# Altium project Memory_EEPROM.PrjPcb
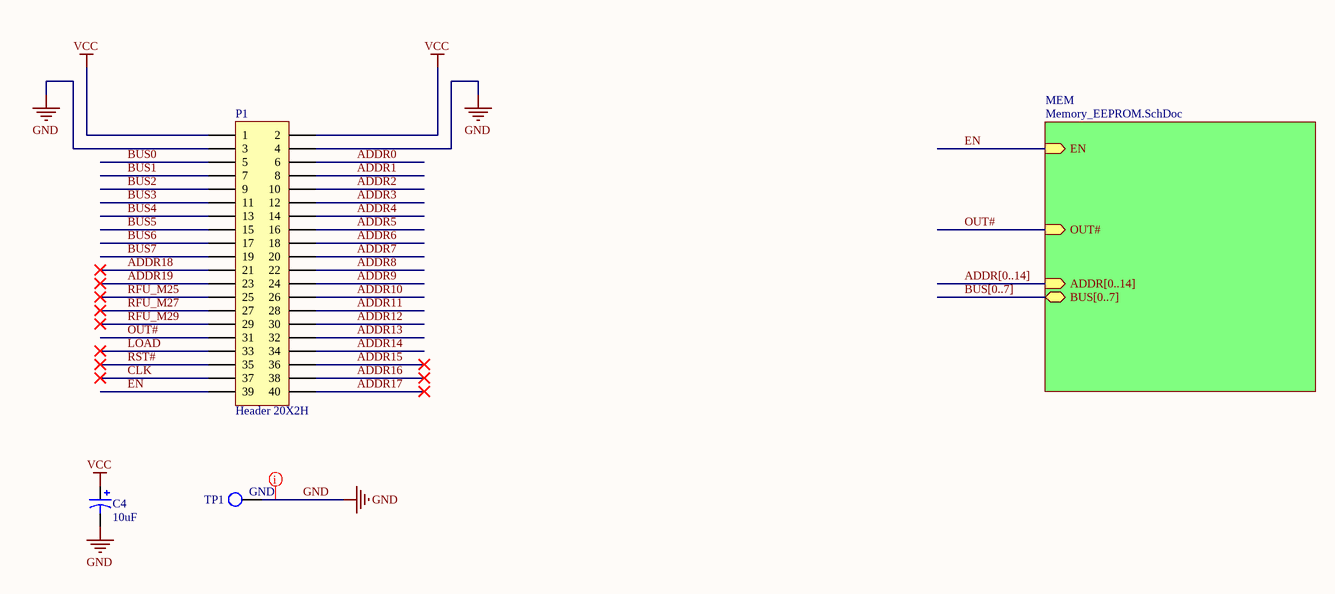
[diagram p0: Top.SchDoc]
2 sheets, 9 parts. Net scope: hierarchical (ports join the sheet entries above them; power ports are global).
Board file: Memory_EEPROM.PcbDoc
Sheets:
  Top.SchDoc
    MEM = Memory_EEPROM.SchDoc

## Sheet Top.SchDoc
size B; Author: E. Sims; Organization: Let's Build Rockets Inc.; SheetNumber: 1; SheetTotal: 2

### Parts
C4  value 10uF  [C5x7]  (hidden comment: Cap Pol5)
P1  Header 20X2H  [HDR2X20H]
TP1  GND  [KSTN-5011_V]  (no BOM)

### Sub-sheets
MEM = Memory_EEPROM.SchDoc: OUT# (in), EN (in), ADDR[0..14] (in), BUS[0..7] (bidir)

### Nets
GND: C4.2 P1.3 P1.4 TP1.1
VCC: C4.1 P1.1 P1.2
ADDR0: P1.6
ADDR1: P1.8
ADDR2: P1.10
ADDR3: P1.12
ADDR4: P1.14
ADDR5: P1.16
ADDR6: P1.18
ADDR7: P1.20
ADDR8: P1.22
ADDR9: P1.24
ADDR10: P1.26
ADDR11: P1.28
ADDR12: P1.30
ADDR13: P1.32
ADDR14: P1.34
ADDR15: P1.36
ADDR16: P1.38
ADDR17: P1.40
ADDR18: P1.21
ADDR19: P1.23
BUS0: P1.5
BUS1: P1.7
BUS2: P1.9
BUS3: P1.11
BUS4: P1.13
BUS5: P1.15
BUS6: P1.17
BUS7: P1.19
CLK: P1.37
EN: P1.39 ; sheet MEM/EN
LOAD: P1.33
OUT#: P1.31 ; sheet MEM/OUT#
RFU_M25: P1.25
RFU_M27: P1.27
RFU_M29: P1.29
RST#: P1.35

### Buses and harness runs
bus ADDR[0..14] = sheet MEM/ADDR[0..14]
bus BUS[0..7] = sheet MEM/BUS[0..7]

### Layout directives
rule Width Constraint [Pref Width = 20mil    Min Width = 20mil    Max Width = 50mil]; rule Routing Via Style [Pref Size = 35mil    Pref Hole Size = 20mil]; net class PWR: GND

### Notes on the sheet
- Let's Build Rocket's Inc. Modular Paylaod System Based on TMP-010 Rev
  For more information visit https://github.com/LetsBuildRockets/Modular-Payload-System
  This work is licensed under CC BY-NC 4.0. To view a copy of this license, visit https://creativecommons.org/licenses/by-nc/4.0
- Title
- Size:
- Date:
- Assembly Variant:
- B
- Number:
- Time:
- Revision:
- Sheet
- of
- Author:
- File:

### Library data of the parts
C4 = Cap Pol5: Polarized Capacitor; Published: 8-Jun-2000; LatestRevisionDate: 17-Jul-2002; LatestRevisionNote: Re-released for DXP Platform.; PackageReference: POLAR0.8; Publisher: Altium Limited; PackageDescription: Polarized Capacitor; 2 Leads
P1 = Header 20X2H: Header, 20-Pin, Dual row, Right Angle; System: Connector; LatestRevisionDate: 17-Jul-2002; LatestRevisionNote: Re-released for DXP Platform.; Publisher: Altium Limited
TP1 = TP

## Sheet Memory_EEPROM.SchDoc
size B; Author: E. Sims; Organization: Let's Build Rockets Inc.; SheetNumber: 2; SheetTotal: 2
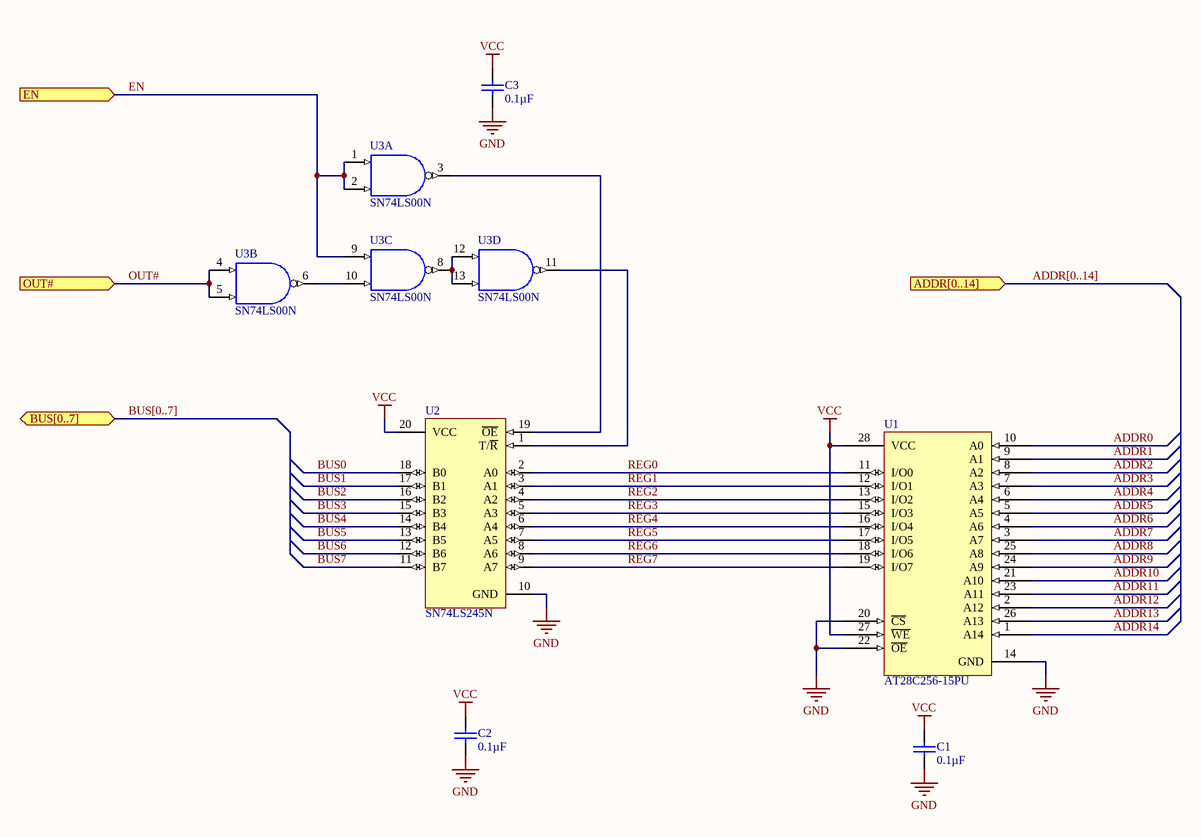
[diagram p1: Memory_EEPROM.SchDoc]

### Parts
C1  Capacitance: 0.1µF  [VISH-K104K15X7RF5TL2]  (hidden comment: K104K15X7RF5TL2)
C2  Capacitance: 0.1µF  [VISH-K104K15X7RF5TL2]  (hidden comment: K104K15X7RF5TL2)
C3  Capacitance: 0.1µF  [VISH-K104K15X7RF5TL2]  (hidden comment: K104K15X7RF5TL2)
U1  AT28C256-15PU  [J028]
U2  SN74LS245N  [N020]
U3  SN74LS00N  [N014]  (parts A,B,C,D of 4)

### Ports
ADDR[0..14] (in), BUS[0..7] (bidir), EN (in), OUT# (in)

### Nets
GND: C1.2 C2.2 C3.2 U1.14(GND) U1.20(~{CS}) U1.22(~{OE}) U2.10(GND) U3.7(GND)
VCC: C1.1 C2.1 C3.1 U1.27(~{WE}) U1.28(VCC) U2.20(VCC) U3.14(VCC)
ADDR0: U1.10(A0)
ADDR1: U1.9(A1)
ADDR2: U1.8(A2)
ADDR3: U1.7(A3)
ADDR4: U1.6(A4)
ADDR5: U1.5(A5)
ADDR6: U1.4(A6)
ADDR7: U1.3(A7)
ADDR8: U1.25(A8)
ADDR9: U1.24(A9)
ADDR10: U1.21(A10)
ADDR11: U1.23(A11)
ADDR12: U1.2(A12)
ADDR13: U1.26(A13)
ADDR14: U1.1(A14)
BUS0: U2.18(B0)
BUS1: U2.17(B1)
BUS2: U2.16(B2)
BUS3: U2.15(B3)
BUS4: U2.14(B4)
BUS5: U2.13(B5)
BUS6: U2.12(B6)
BUS7: U2.11(B7)
EN: U3.1(A) U3.2(B) U3.9(A) ; port EN
OUT#: U3.4(A) U3.5(B) ; port OUT#
REG0: U1.11(I/O0) U2.2(A0)
REG1: U1.12(I/O1) U2.3(A1)
REG2: U1.13(I/O2) U2.4(A2)
REG3: U1.15(I/O3) U2.5(A3)
REG4: U1.16(I/O4) U2.6(A4)
REG5: U1.17(I/O5) U2.7(A5)
REG6: U1.18(I/O6) U2.8(A6)
REG7: U1.19(I/O7) U2.9(A7)
NetU2_1: U2.1(T/~{R}) U3.11(Y)
NetU2_19: U2.19(~{OE}) U3.3(Y)
NetU3_6: U3.6(Y) U3.10(B)
NetU3_8: U3.8(Y) U3.12(A) U3.13(B)

### Buses and harness runs
bus ADDR[0..14] = port ADDR[0..14]
bus BUS[0..7] = port BUS[0..7]

### Notes on the sheet
- Let's Build Rocket's Inc. Modular Paylaod System Based on TMP-010 Rev
  For more information visit https://github.com/LetsBuildRockets/Modular-Payload-System
  This work is licensed under CC BY-NC 4.0. To view a copy of this license, visit https://creativecommons.org/licenses/by-nc/4.0
- Title
- Size:
- Date:
- Assembly Variant:
- B
- Number:
- Time:
- Revision:
- Sheet
- of
- Author:
- File:

### Library data of the parts
C1-C3 = CMP-2000-06508-1: Ceramic Capacitor, 100 nF, +/- 10%, 50 V, -55 to 125 degC, 2-Pin THD, RoHS, Tape and Reel; Manufacturer: Vishay; Other Names: BC1084CT; Catalog Drawings: Mono-KapSide2-15_5.58Mono-KapSide1_15; Temperature Coefficient: X7R; Voltage - Rated: 50V; Online Catalog: Mono-Kap™Series; Size / Dimension: 0.157"Lx0.098"W(4.00mmx2.50mm); Operating Temperature: -55°C~125°C; Family: CeramicCapacitors; Manufacturer URL: http://www.vishay.com/; Standard Package: 1; Thickness (Max): -; Ratings: -; Datasheet Version: 08/2013; Package Description: 2-Pin Through Hole Device, Body 4 x 2.6 mm; Mounting Type: ThroughHole; Features: -; Lead Spacing: 0.098"(2.50mm); Tolerance: ±10%; Category: Capacitors; Mounting Technology: ThroughHole; Lead Style: Straight; Datasheet URL: http://www.vishay.com/docs/45171/kseries.pdf; Applications: GeneralPurpose; Package / Case: Radial; Height - Seated (Max): 0.220"(5.58mm); Package Reference: K104K15X7RF5TL2; Series: Mono-Kap™K; Packaging: CutTape(CT)
U2 = SN74LS245N: Octal Bus Transceiver with 3-State Outputs; Published: 8-Jun-2000; LatestRevisionDate: 04-Mar-2005; LatestRevisionNote: Stylized 3D Model Added.; DatasheetVersion: Mar-1988; PackageVersion: Oct-1995; PackageReference: N020; Publisher: Altium Limited; PackageDescription: DIP; 20 Leads; Row Spacing 7.62 mm; Pitch 2.54 mm; ComponentLink1Description: Manufacturer Link; ComponentLink1URL: http://www.ti.com/; ComponentLink2Description: Datasheet; ComponentLink2URL: http://www-s.ti.com/sc/ds/sn74ls245.pdf
U3 = SN74LS00N: Quadruple 2-Input Positive-NAND Gate; Published: 8-Jun-2000; LatestRevisionDate: 04-Mar-2005; LatestRevisionNote: Stylized 3D Model Added.; DatasheetVersion: Mar-1988; PackageVersion: Oct-1995; PackageReference: N014; Publisher: Altium Limited; PackageDescription: DIP; 14 Leads; Row Spacing 7.62 mm; Pitch 2.54 mm; ComponentLink1Description: Manufacturer Link; ComponentLink1URL: http://www.ti.com/; ComponentLink2Description: Datasheet; ComponentLink2URL: http://www-s.ti.com/sc/ds/sn74ls00.pdf

## Nets that join several sheets
GND: Top (C4.2 P1.3 P1.4 TP1.1), Memory_EEPROM (8 pins)
VCC: Top (C4.1 P1.1 P1.2), Memory_EEPROM (7 pins)
ADDR0: Top (P1.6), Memory_EEPROM (U1.10)
ADDR1: Top (P1.8), Memory_EEPROM (U1.9)
ADDR2: Top (P1.10), Memory_EEPROM (U1.8)
ADDR3: Top (P1.12), Memory_EEPROM (U1.7)
ADDR4: Top (P1.14), Memory_EEPROM (U1.6)
ADDR5: Top (P1.16), Memory_EEPROM (U1.5)
ADDR6: Top (P1.18), Memory_EEPROM (U1.4)
ADDR7: Top (P1.20), Memory_EEPROM (U1.3)
ADDR8: Top (P1.22), Memory_EEPROM (U1.25)
ADDR9: Top (P1.24), Memory_EEPROM (U1.24)
ADDR10: Top (P1.26), Memory_EEPROM (U1.21)
ADDR11: Top (P1.28), Memory_EEPROM (U1.23)
ADDR12: Top (P1.30), Memory_EEPROM (U1.2)
ADDR13: Top (P1.32), Memory_EEPROM (U1.26)
ADDR14: Top (P1.34), Memory_EEPROM (U1.1)
BUS0: Top (P1.5), Memory_EEPROM (U2.18)
BUS1: Top (P1.7), Memory_EEPROM (U2.17)
BUS2: Top (P1.9), Memory_EEPROM (U2.16)
BUS3: Top (P1.11), Memory_EEPROM (U2.15)
BUS4: Top (P1.13), Memory_EEPROM (U2.14)
BUS5: Top (P1.15), Memory_EEPROM (U2.13)
BUS6: Top (P1.17), Memory_EEPROM (U2.12)
BUS7: Top (P1.19), Memory_EEPROM (U2.11)
EN: Top (P1.39), Memory_EEPROM (U3.1 U3.2 U3.9)
OUT#: Top (P1.31), Memory_EEPROM (U3.4 U3.5)